# Altium schematic sheet FPGA_IO_MCU.SchDoc
size A4
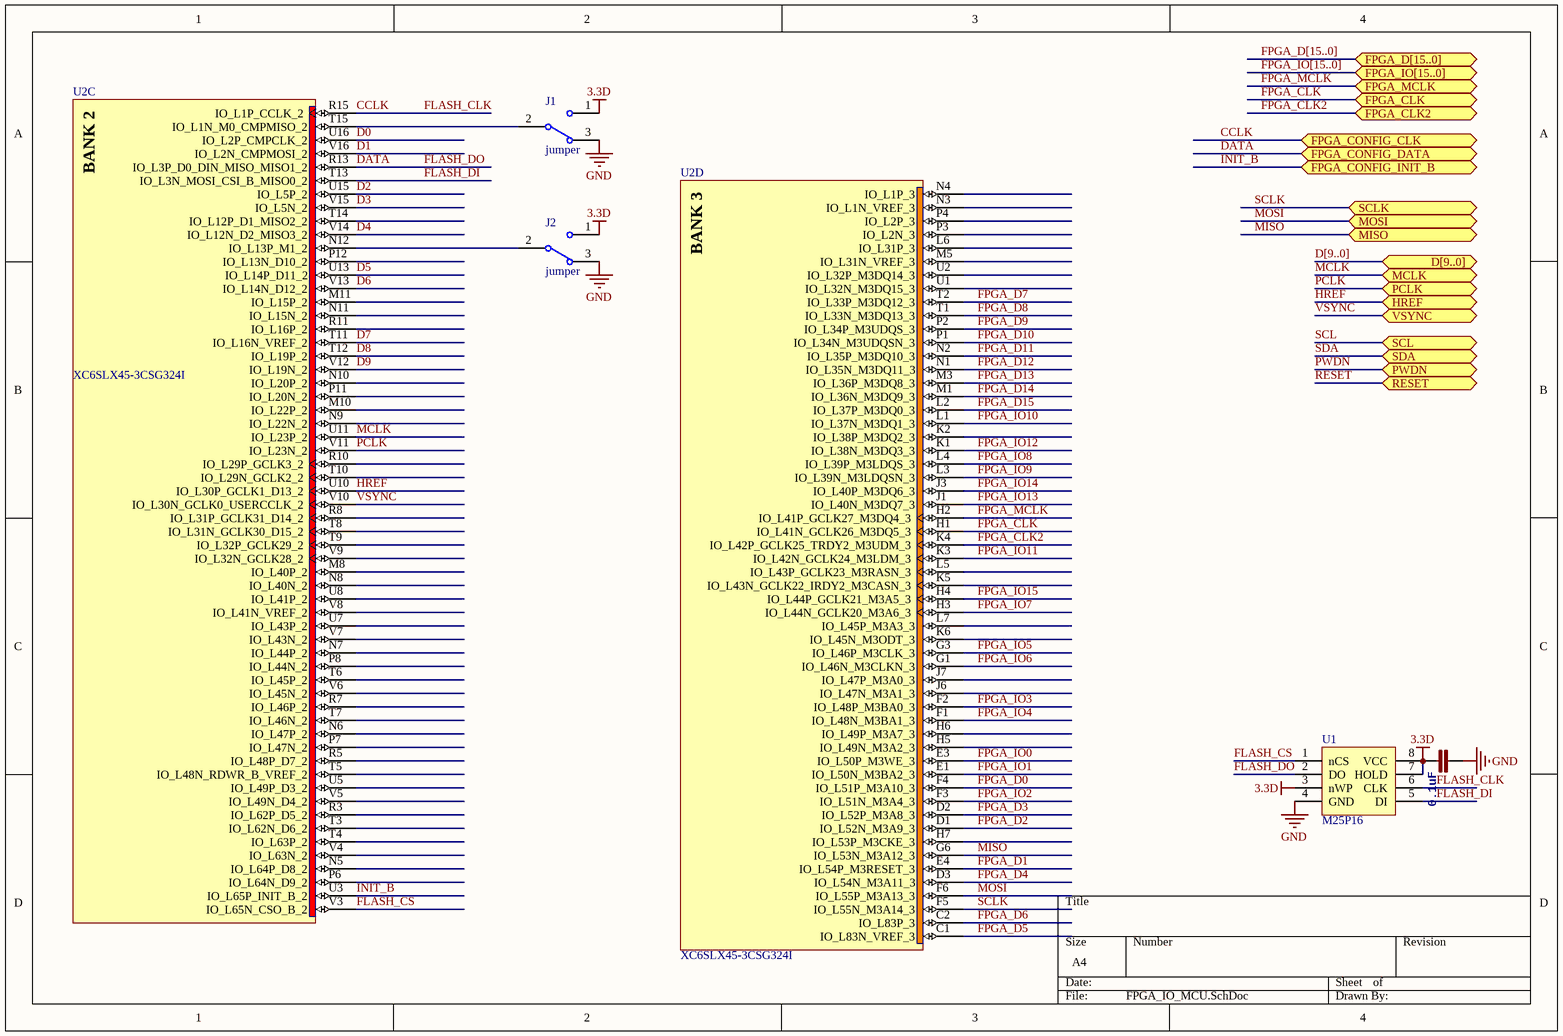
[diagram p0: FPGA_IO_MCU.SchDoc]

## Parts
C68  0.1uF  [0402]
J1  jumper  [0402J]
J2  jumper  [0402J]
U1  M25P16  [SO8]
U2  XC6SLX45-3CSG324I  [CSG324]  (parts C,D of 8)

## Ports
D[9..0], FPGA_CLK, FPGA_CLK2, FPGA_CONFIG_CLK, FPGA_CONFIG_DATA, FPGA_CONFIG_INIT_B, FPGA_D[15..0], FPGA_IO[15..0], FPGA_MCLK, HREF, MCLK, MISO, MOSI, PCLK, PWDN, RESET, SCL, SCLK, SDA, VSYNC

## Nets
3.3D: C68.2 J1.1 J2.1 U1.3(nWP) U1.7(HOLD) U1.8(VCC)
GND: C68.1 J1.3 J2.3 U1.4(GND)
CCLK: U1.6(CLK) U2.R15(IO_L1P_CCLK_2) ; port FPGA_CONFIG_CLK  [also labelled FLASH_CLK]
D0: U2.U16(IO_L2P_CMPCLK_2)
D1: U2.V16(IO_L2N_CMPMOSI_2)
D2: U2.U15(IO_L5P_2)
D3: U2.V15(IO_L5N_2)
D4: U2.V14(IO_L12N_D2_MISO3_2)
D5: U2.U13(IO_L14P_D11_2)
D6: U2.V13(IO_L14N_D12_2)
D7: U2.T11(IO_L16N_VREF_2)
D8: U2.T12(IO_L19P_2)
D9: U2.V12(IO_L19N_2)
DATA: U1.2(DO) U2.R13(IO_L3P_D0_DIN_MISO_MISO1_2) ; port FPGA_CONFIG_DATA  [also labelled FLASH_DO]
FLASH_CS: U1.1(nCS) U2.V3(IO_L65N_CSO_B_2)
FLASH_DI: U1.5(DI) U2.T13(IO_L3N_MOSI_CSI_B_MISO0_2)
FPGA_CLK: U2.H1(IO_L41N_GCLK26_M3DQ5_3) ; port FPGA_CLK
FPGA_CLK2: U2.K4(IO_L42P_GCLK25_TRDY2_M3UDM_3) ; port FPGA_CLK2
FPGA_D0: U2.F4(IO_L51P_M3A10_3)
FPGA_D1: U2.E4(IO_L54P_M3RESET_3)
FPGA_D2: U2.D1(IO_L52N_M3A9_3)
FPGA_D3: U2.D2(IO_L52P_M3A8_3)
FPGA_D4: U2.D3(IO_L54N_M3A11_3)
FPGA_D5: U2.C1(IO_L83N_VREF_3)
FPGA_D6: U2.C2(IO_L83P_3)
FPGA_D7: U2.T2(IO_L33P_M3DQ12_3)
FPGA_D8: U2.T1(IO_L33N_M3DQ13_3)
FPGA_D9: U2.P2(IO_L34P_M3UDQS_3)
FPGA_D10: U2.P1(IO_L34N_M3UDQSN_3)
FPGA_D11: U2.N2(IO_L35P_M3DQ10_3)
FPGA_D12: U2.N1(IO_L35N_M3DQ11_3)
FPGA_D13: U2.M3(IO_L36P_M3DQ8_3)
FPGA_D14: U2.M1(IO_L36N_M3DQ9_3)
FPGA_D15: U2.L2(IO_L37P_M3DQ0_3)
FPGA_IO0: U2.E3(IO_L50P_M3WE_3)
FPGA_IO1: U2.E1(IO_L50N_M3BA2_3)
FPGA_IO2: U2.F3(IO_L51N_M3A4_3)
FPGA_IO3: U2.F2(IO_L48P_M3BA0_3)
FPGA_IO4: U2.F1(IO_L48N_M3BA1_3)
FPGA_IO5: U2.G3(IO_L46P_M3CLK_3)
FPGA_IO6: U2.G1(IO_L46N_M3CLKN_3)
FPGA_IO7: U2.H3(IO_L44N_GCLK20_M3A6_3)
FPGA_IO8: U2.L4(IO_L39P_M3LDQS_3)
FPGA_IO9: U2.L3(IO_L39N_M3LDQSN_3)
FPGA_IO10: U2.L1(IO_L37N_M3DQ1_3)
FPGA_IO11: U2.K3(IO_L42N_GCLK24_M3LDM_3)
FPGA_IO12: U2.K1(IO_L38N_M3DQ3_3)
FPGA_IO13: U2.J1(IO_L40N_M3DQ7_3)
FPGA_IO14: U2.J3(IO_L40P_M3DQ6_3)
FPGA_IO15: U2.H4(IO_L44P_GCLK21_M3A5_3)
FPGA_MCLK: U2.H2(IO_L41P_GCLK27_M3DQ4_3) ; port FPGA_MCLK
HREF: U2.U10(IO_L30P_GCLK1_D13_2) ; port HREF
INIT_B: U2.U3(IO_L65P_INIT_B_2) ; port FPGA_CONFIG_INIT_B
MCLK: U2.U11(IO_L23P_2) ; port MCLK
MISO: U2.G6(IO_L53N_M3A12_3) ; port MISO
MOSI: U2.F6(IO_L55P_M3A13_3) ; port MOSI
PCLK: U2.V11(IO_L23N_2) ; port PCLK
PWDN: port PWDN
RESET: port RESET
SCL: port SCL
SCLK: U2.F5(IO_L55N_M3A14_3) ; port SCLK
SDA: port SDA
VSYNC: U2.V10(IO_L30N_GCLK0_USERCCLK_2) ; port VSYNC
NetJ1_2: J1.2 U2.T15(IO_L1N_M0_CMPMISO_2)
NetJ2_2: J2.2 U2.N12(IO_L13P_M1_2)

Not connected (* = marked no-connect by the designer): U2 H5(IO_L49N_M3A2_3) H6(IO_L49P_M3A7_3) H7(IO_L53P_M3CKE_3) J6(IO_L47N_M3A1_3) J7(IO_L47P_M3A0_3) K2(IO_L38P_M3DQ2_3) K5(IO_L43N_GCLK22_IRDY2_M3CASN_3) K6(IO_L45N_M3ODT_3) L5(IO_L43P_GCLK23_M3RASN_3) L6(IO_L31P_3) L7(IO_L45P_M3A3_3) M5(IO_L31N_VREF_3) M8(IO_L40P_2) M10(IO_L22P_2) M11(IO_L15P_2) N3(IO_L1N_VREF_3) N4(IO_L1P_3) N5(IO_L64P_D8_2) N6(IO_L47P_2) N7(IO_L44P_2) N8(IO_L40N_2) N9(IO_L22N_2) N10(IO_L20P_2) N11(IO_L15N_2) P3(IO_L2N_3) P4(IO_L2P_3) P6(IO_L64N_D9_2) P7(IO_L47N_2) P8(IO_L44N_2) P11(IO_L20N_2) P12(IO_L13N_D10_2) R3(IO_L62P_D5_2) R5(IO_L48P_D7_2) R7(IO_L46P_2) R8(IO_L31P_GCLK31_D14_2) R10(IO_L29P_GCLK3_2) R11(IO_L16P_2) T3(IO_L62N_D6_2) T4(IO_L63P_2) T5(IO_L48N_RDWR_B_VREF_2) T6(IO_L45P_2) T7(IO_L46N_2) T8(IO_L31N_GCLK30_D15_2) T9(IO_L32P_GCLK29_2) T10(IO_L29N_GCLK2_2) T14(IO_L12P_D1_MISO2_2) U1(IO_L32N_M3DQ15_3) U2(IO_L32P_M3DQ14_3) U5(IO_L49P_D3_2) U7(IO_L43P_2) U8(IO_L41P_2) V4(IO_L63N_2) V5(IO_L49N_D4_2) V6(IO_L45N_2) V7(IO_L43N_2) V8(IO_L41N_VREF_2) V9(IO_L32N_GCLK28_2)

## Buses and harness runs
bus D[9..0] = port D[9..0]
bus FPGA_D[15..0] = port FPGA_D[15..0]
bus FPGA_IO[15..0] = port FPGA_IO[15..0]

## Notes on the sheet
- (in symbol XC6SLX45-3CSG324I, part C) BANK 2
- (in symbol XC6SLX45-3CSG324I, part D) BANK 3

## Library data of the parts
C68 = CAP0402-CAP: <b>Capacitor</b> / Standard 0603 ceramic capacitor, and 0.1" leaded capacitor.; PARTNO: CC0402ZRY5V7BB104
J1 J2 = SW-SPDT: SPDT Subminiature Toggle Switch, Right Angle Mounting, Vertical Actuation; Published: 24-Mar-1999; LatestRevisionDate: 17-Dec-2003; LatestRevisionNote: Schematic revised, PCB Footprint replaced.; DatasheetVersion: 05-Dec-2000; PackageReference: TL36WW15050; Publisher: Altium Limited; PackageDescription: Switch; 4 Leads; ComponentLink1Description: Manufacturer Link; ComponentLink1URL: http://www.apem.com
U2 = XC6SLX45-3CSG324I: Spartan-6 LX 1.2V FPGA, 218 User I/Os, 324-Ball Chip-Scale BGA (0.8mm Pitch), Speed Grade 3, Industrial Grade, Pb-Free; Published: 17-Nov-2009; DatasheetVersion: ver1.6, Nov-2010; PackageVersion: ver1.1, Nov-2009; PackageReference: CSG324; Publisher: Altium Limited; PackageDescription: 324-Ball Chip-Scale BGA (CSG324) Package, 0.8 mm Pitch; Supplier 1: Digi-Key; Supplier Part Number 1: XC6SLX45-3CSG324I-ND; Code_JEDEC: MO-275-KKAC-1; ComponentLink1Description: Manufacturer Link; ComponentLink1URL: http://www.xilinx.com; ComponentLink2Description: Spartan-6 Datasheet; ComponentLink2URL: http://www.xilinx.com/support/documentation/data_sheets/ds160.pdf; ComponentLink3Description: Spartan-6 Documents; ComponentLink3URL: http://www.xilinx.com/support/documentation/spartan-6.htm; ComponentLink4Description: Xilinx.com Home; ComponentLink4URL: http://www.xilinx.com